# EAGLE schematic PRG_APT (EAGLE 7.5.0)
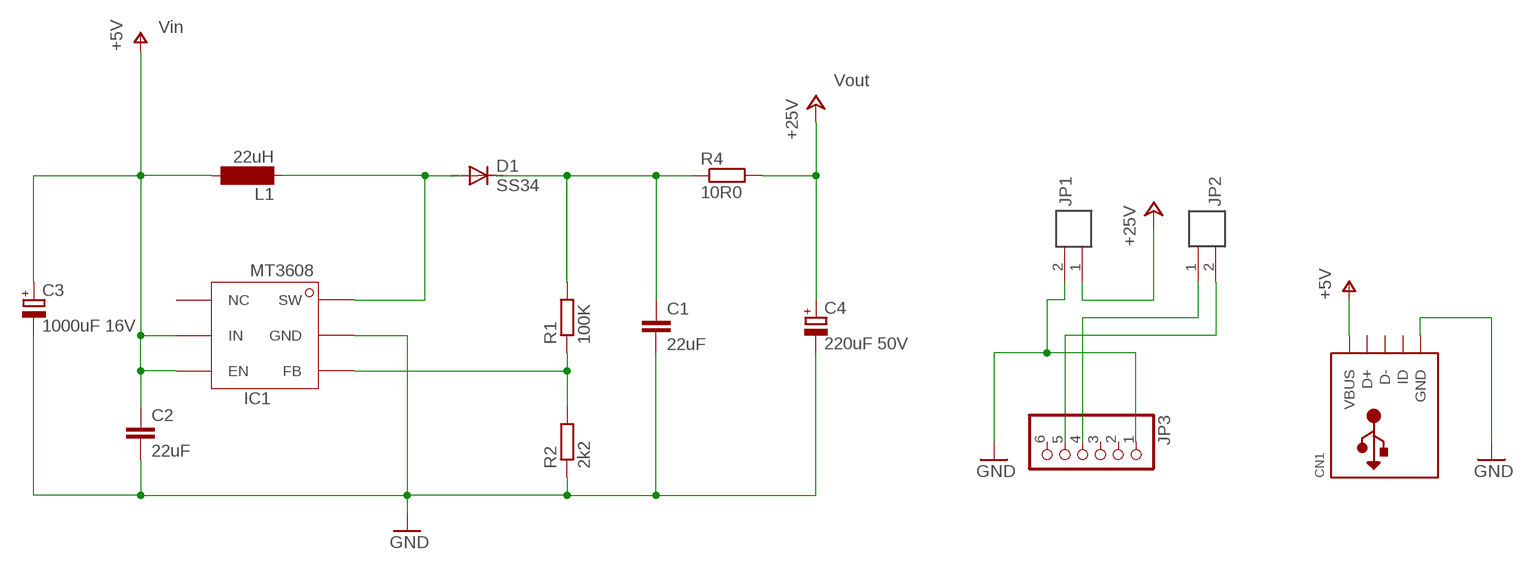
[diagram p0: schematic, sheet 1]

## Parts
C1  22uF  C-EUC0805  [C0805]
C2  22uF  C-EUC0805  [C0805]
C3  1000uF 16V  CPOL-EU153CLV-0810  [153CLV-0810]
C4  220uF 50V  CPOL-EU153CLV-1010  [153CLV-1010]
CN1  USBMINIB  [USB-MINIB]
D1  SS34  DIODE-DO-214AC  [DO-214AC]
IC1  MT3608SOT23-6  [SOT23-6]
JP1  ARK254-2  [ARK254-2]
JP2  ARK254-2  [ARK254-2]
JP3  PINHD-1X6  [1X06]
L1  22uH  SLF12555T-102MR34-PF  [SLF12555T-102MR34-PF]
R1  100K  R-EU_R0805  [R0805]
R2  2k2  R-EU_R0805  [R0805]
R4  10R0  R-EU_M1206  [M1206]

## Nets
+25V: C4.+ JP1.1 R4.2
GND: C1.2 C2.2 C3.- C4.- CN1.GND IC1.P$2(GND) JP1.2 JP3.1 R2.1
N$2: D1.A IC1.P$1(SW) L1.P$1
N$3: IC1.P$3(FB) R1.1 R2.2
N$6: JP2.1 JP3.4
N$7: JP2.2 JP3.5
N$22: C1.1 D1.C R1.2 R4.1
V+: C2.1 C3.+ CN1.VBUS IC1.P$4(EN) IC1.P$5(IN) L1.P$2 ; supply symbol labelled +5V
Unconnected: CN1.D+ CN1.D- CN1.ID IC1.P$6(NC) JP3.2 JP3.3 JP3.6

## Notes on the sheet
- Vin
- Vout

## Library data of the parts
C1 C2 = resistor:C-EU: CAPACITOR, European symbol
C3 C4 = resistor:CPOL-EU: POLARIZED CAPACITOR, European symbol
CN1 = adafruit:USB: USB Connectors USBMINIB - Surface Mount Female Mini-B USB Connector 4UConnector: 06564 By microbuilder.eu Thru-hole RA Female Mini-B USB Connector 4UConnector: 18732 By ladyada.net
D1 = diode:DIODE-: DIODE
IC1 = mt3608:MT3608: MT3608 High Efficiency 1.2MHz 2A Step Up Converter BY: Rangana Tennakoon
JP1 JP2 = _marek:ARK254-2
JP3 = pinhead:PINHD-1X6: PIN HEADER
L1 = _marek:SLF12555T-102MR34-PF
R1 R2 R4 = resistor:R-EU_: RESISTOR, European symbol